# EAGLE design Grove - Recorder v2.0 (EAGLE 7.1.0)
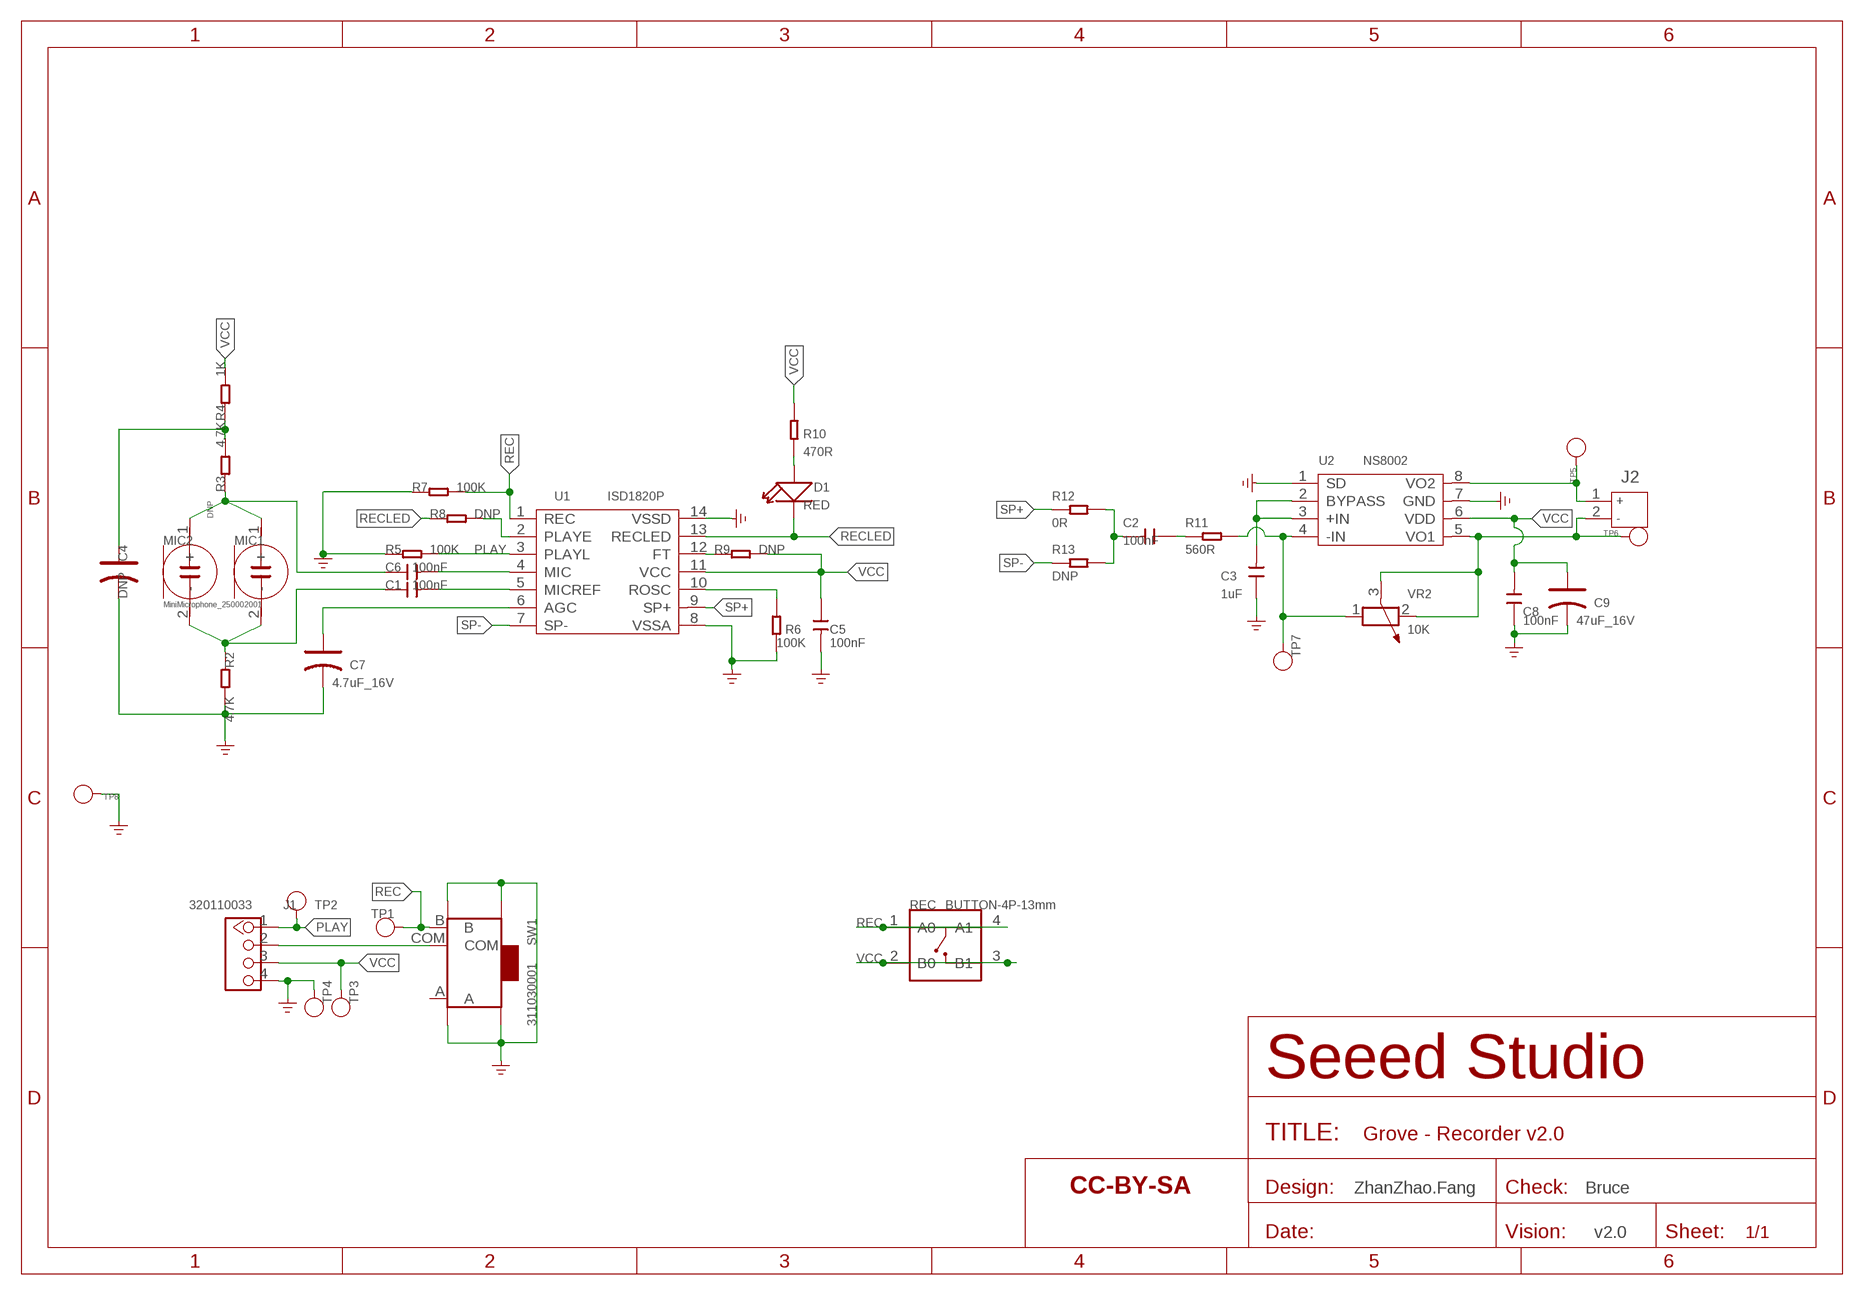
[diagram p0: schematic, sheet 1]

## Parts
C1  100nF  C-0402  [C0402]
C2  100nF  CAP-0603  [C0603]
C3  1uF  CAP-0402  [C0402]
C4  DNP  CAP-AVX-A  [AVX-A]
C5  100nF  C-0402  [C0402]
C6  100nF  C-0402  [C0402]
C7  4.7uF_16V  C-POLAR-A  [AVX-A]
C8  100nF  CAP-0402  [C0402]
C9  47uF_16V  C-POLAR-B  [AVX-B]
D1  RED  LED'RIGHT'  [LED-SIDE-VIEW-0603-RIGHT]
FR1  SEEEDSTUDIO-OPEN-SCH-FRAME  [SEEEDSTUDIO-PCB-FRAME]
J1  320110033  GROVE-CONNECTOR-DIP-2.0  [HW4-2.0]
J2  2P-2.0  JACK-JST-2P-PW'2.0'  [JST-2.0]
MIC1  MiniMicrophone_250002001  MICROPHONE  [2P-D8.9MM]
MIC2  DNP  MICROPHONE  [2P-D8.9MM]
R2  4.7K  R-0402  [R0402]
R3  4.7K  R-0402  [R0402]
R4  1K  R-0402  [R0402]
R5  100K  R-0402  [R0402]
R6  100K  R-0402  [R0402]
R7  100K  R-0402  [R0402]
R8  DNP  R-0402  [R0402]
R9  DNP  R-0402  [R0402]
R10  470R  R-0402  [R0402]
R11  560R  RES-0402  [R0402]
R12  0R  R-0402  [R0402]
R13  DNP  R-0402  [R0402]
REC  BUTTON-4P-13mm  BUTTON-4P-3110040P1  [4P-6.0X6.0X5.0H]
SW1  311030001  SWITCH-3+4P  [SW7-SMD-L6.7X2.7X3.2MM]
TP1  DNP  TEST-POINT'4545'  [TP-D45MIL]
TP2  DNP  TEST-POINT'4545'  [TP-D45MIL]
TP3  DNP  TEST-POINT'4545'  [TP-D45MIL]
TP4  DNP  TEST-POINT'4545'  [TP-D45MIL]
TP5  DNP  PAD-TEST-POINT'4545'  [TP_4545]
TP6  DNP  PAD-TEST-POINT'4545'  [TP_4545]
TP7  DNP  TEST-POINT'4545'  [TP-D45MIL]
TP8  DNP  PAD-TEST-POINT'4545'  [TP_4545]
U1  ISD1820P  [DIP14]
U2  NS8002  AMPLIFIER-NS8002  [SOIC8-1.27-5X4MM]
VR2  10K  RES-ADJ-SX3362P  [ADJR3-7.0X7.0X5.0MM]

## Nets
GND: C3.1 C4.- C5.2 C7.- C8.1 C9.- J1.4 R2.2 R5.1 R6.1 R7.1 SW1.SS1 SW1.SS2 SW1.SS3 SW1.SS4 TP4.T TP8.T U1.8(VSSA) U1.14(VSSD) U2.1(SD) U2.7(GND) ; supply symbol labelled GND_POWER
N$1: R8.2 U1.2(PLAYE)
N$2: D1.1(+) R10.1
N$3: J2.1 TP5.T U2.8(VO2)
N$4: J2.2 TP6.T U2.5(VO1) VR2.2 VR2.3
N$6: C7.+ U1.6(AGC)
N$7: C1.2 U1.5(MICREF)
N$8: C6.2 U1.4(MIC)
N$9: C3.2 U2.2(BYPASS) U2.3(+IN)
N$11: C2.1 R11.1
N$12: R11.2 TP7.T U2.4(-IN) VR2.1
N$13: R9.1 U1.12(FT)
N$14: C2.2 R12.1 R13.1
N$15: R6.2 U1.10(ROSC)
N$16: C4.+ R3.2 R4.1
N$17: J1.2 SW1.COM
N$19: C6.1 MIC1.1(+) MIC2.1(+) R3.1
N$20: C1.1 MIC1.2(-) MIC2.2(-) R2.1
PLAY: J1.1 R5.2 TP2.T U1.3(PLAYL)
REC: R7.2 REC.1(A0) REC.4(A1) SW1.B TP1.T U1.1(REC)
RECLED: D1.2(-) R8.1 U1.13(RECLED)
SP+: R12.2 U1.9(SP+)
SP-: R13.2 U1.7(SP-)
VCC: C5.1 C8.2 C9.+ J1.3 R4.2 R9.2 R10.2 REC.2(B0) REC.3(B1) TP3.T U1.11(VCC) U2.6(VDD)
Unconnected: SW1.A

## Notes on the sheet
- ZhanZhao.Fang | Bruce
- v2.0

## Library data of the parts
C1 C5 C6 = Discrete:C*: Ceramic Capacitors
C2 C3 C8 = Discrete-new:CAP: Ceramic Capacitors
C4 = Discrete:CAP*: Electrolytic Capacitors,Tantalum Capacitors and Super Capacitors
C7 C9 = OPL:C-POLAR*
D1 = Discrete:LED*
FR1 = moudle-new:SEEEDSTUDIO-OPEN-SCH-FRAME
J1 = Connector-new:GROVE-CONNECTOR-DIP: 4P-2.0:320110033;4P-2.0-90D:320110034
J2 = Connector :JACK-JST-2P-PW
MIC1 MIC2 = Discrete:MICROPHONE
R2-R10 R12 R13 = Discrete:R*
R11 = Discrete-new:RES
REC = OPL:BUTTON-4P
SW1 = Discrete-new:SWITCH-3+4P: SW7-SMD-6.7X2.6X1.4MM-90D:311030002;SW7-SMD-L6.7X2.7X3.2MM:311030001
TP1-TP4 TP7 = Discrete-new:TEST-POINT; PARTNO: DNP
TP5 TP6 TP8 = Discrete:PAD-TEST-POINT; PARTNO: DNP
U1 = template:ISD1820P
U2 = IC-new:AMPLIFIER-NS8002: 310020023
VR2 = Discrete-new:RES-ADJ: Potentiometer

## Net classes
0 default: width 0.152 mm, drill 0.305 mm, clearance 0.152 mm
3 none3: width 0.203 mm, drill 0.305 mm, clearance 0.203 mm

## Board
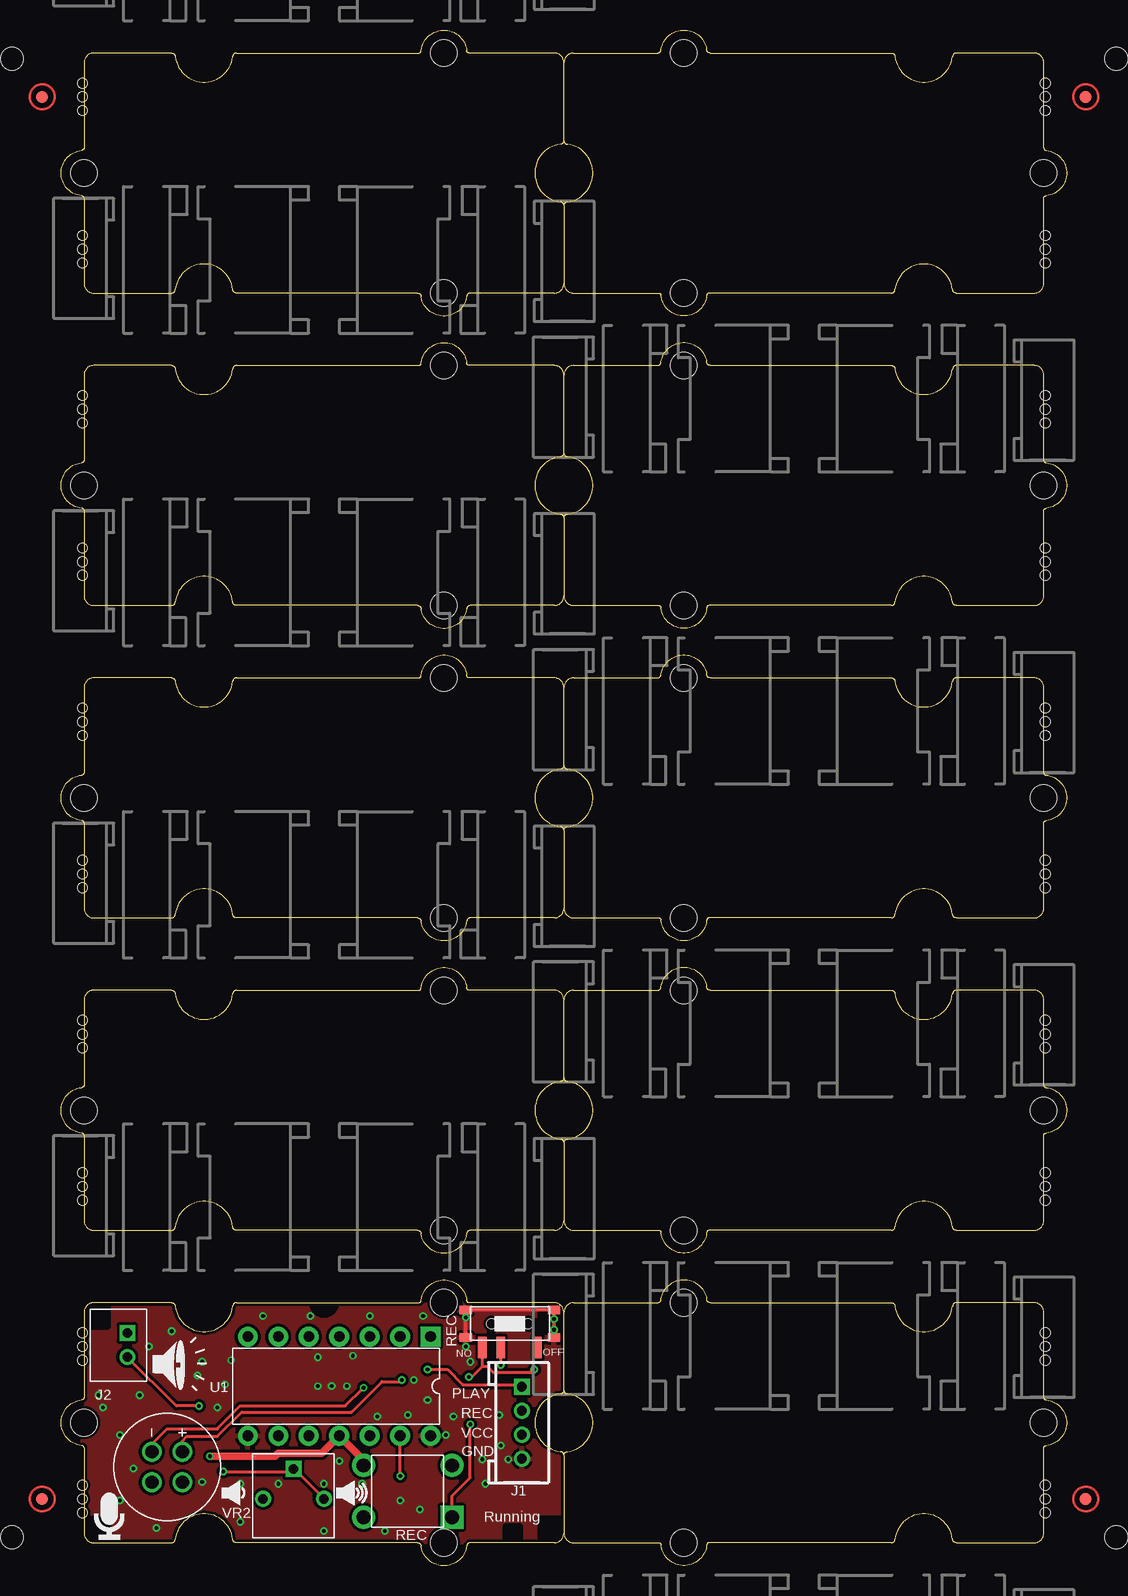
[diagram p1: board, top side]
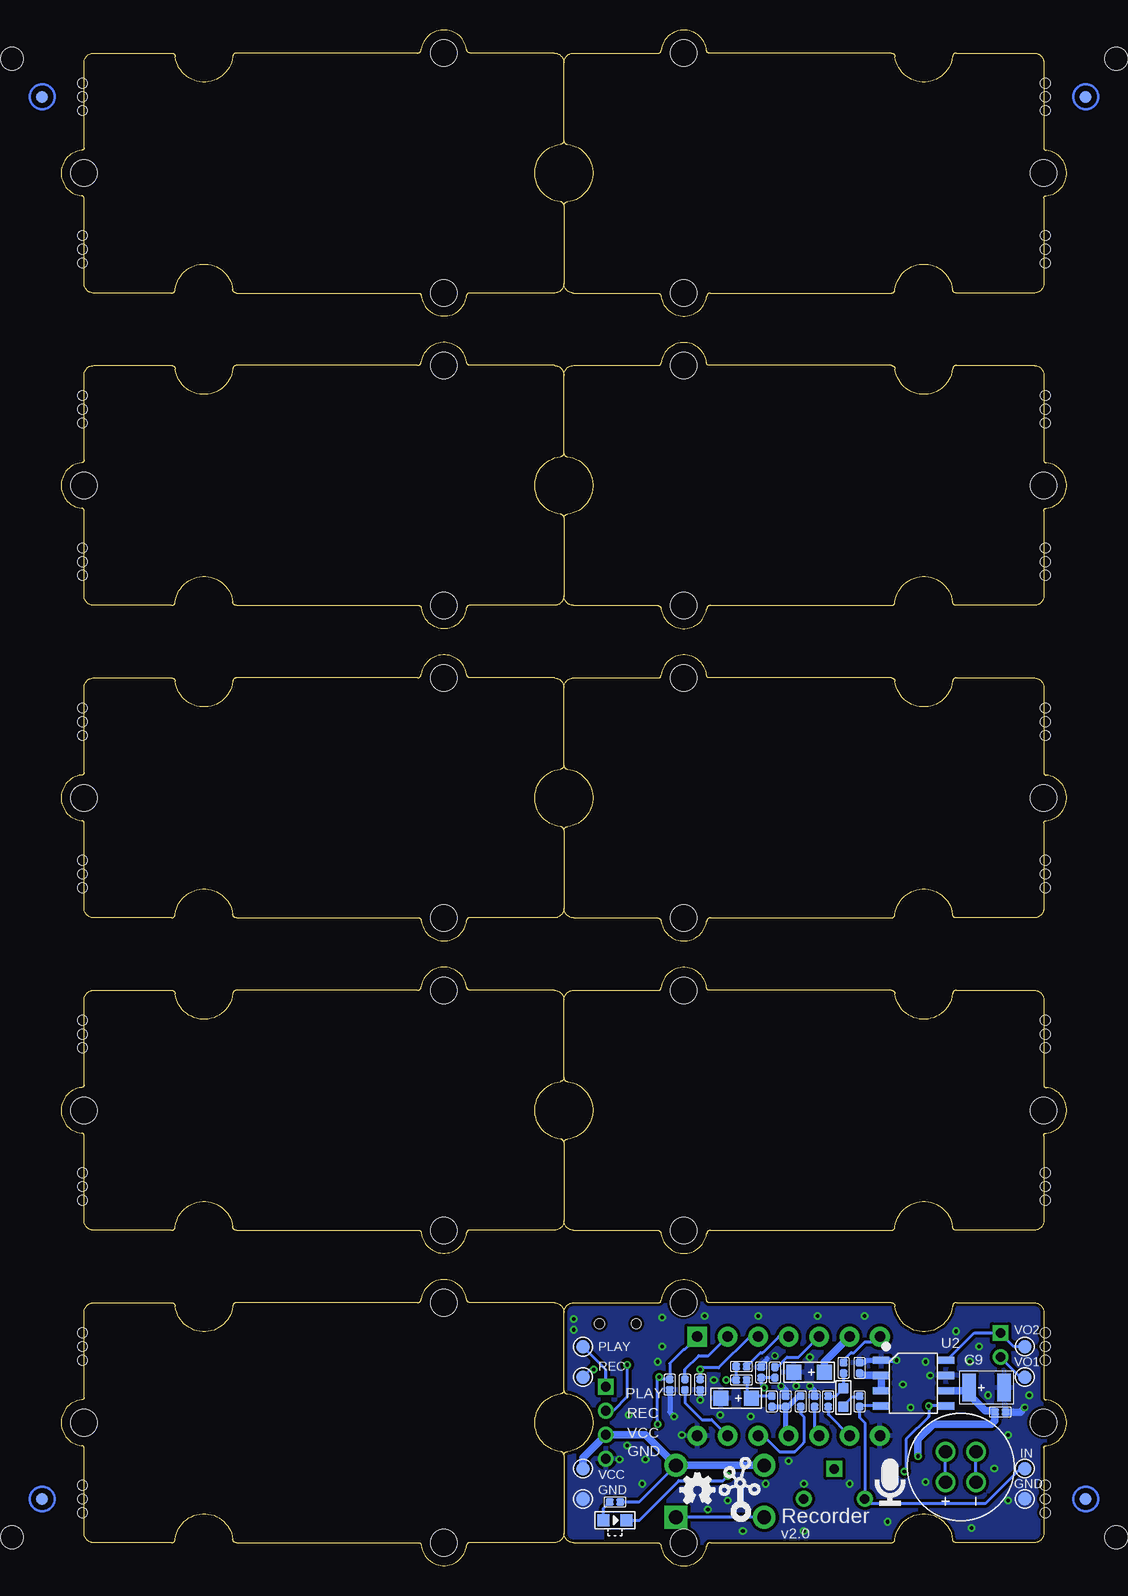
[diagram p2: board, bottom side, seen from below]

Size 83.82 x 127.98 mm. Coordinates in mm from the lower left corner, seen from the top.
Copper layers (1*16): Top 0.035mm / dielectric 1.5mm / Bottom 0.035mm
Design rules "default *": minimum track width 6mil, minimum drill 12mil, track to track 6mil, track to pad 6mil, pad to pad 6mil, via to via 6mil, smd to smd 0mil, copper to edge 10mil, drill to drill 10mil, minimum pad ring 10mil, minimum via ring 6mil, stop-mask expansion 2mil, vias tented up to drill 100mil, thermal gap 10mil
Holes 0.8 mm at 82.04,4.43 82.04,6.71 82.04,5.57 82.04,17.13 82.04,19.41 82.04,18.27 82.04,30.46 82.04,32.75 82.04,31.61 82.04,43.16 82.04,45.45 82.04,44.31 82.04,56.5 82.04,58.78 82.04,57.64 82.04,69.2 82.04,71.48 82.04,70.34 82.04,82.53 82.04,84.82 82.04,83.68 82.04,95.23 82.04,97.52 82.04,96.38 82.04,108.57 82.04,110.85 82.04,109.71 82.04,121.27 82.04,123.55 82.04,122.41 1.78,6.71 1.78,4.43 1.78,5.57 1.78,19.41 1.78,17.13 1.78,18.27 1.78,32.75 1.78,30.46 1.78,31.61 1.78,45.45 1.78,43.16 1.78,44.31 1.78,58.78 1.78,56.5 1.78,57.64 1.78,71.48 1.78,69.2 1.78,70.34 1.78,84.82 1.78,82.53 1.78,83.68 1.78,97.52 1.78,95.23 1.78,96.38 1.78,110.85 1.78,108.57 1.78,109.71 1.78,123.55 1.78,121.27 1.78,122.41
Holes 1.91 mm at 87.95,125.59 -4.13,125.59 -4.13,2.4 87.95,2.4
tRestrict: area 37,2 to 38.3,3.3
bRestrict: area 37,2 to 38.3,3.3

### Footprints (pad centres in the part's own frame; a part is rotated, then mirrored left to right if it is on the bottom)
C0402 = smd 0.635 x 0.635: 1 -0.445,0; 2 0.445,0
C0603 = smd 0.889 x 0.889: 1 0,0.762; 2 0,-0.762
C0402' = smd 0.635 x 0.635: 1 0,0.445; 2 0,-0.445
AVX-A = smd 1.27 x 1.27: + -1.27,0; - 1.27,0
AVX-B = smd 1.143 x 2.286: + -1.46,0; - 1.46,0
LED-SIDE-VIEW-0603-RIGHT = smd 1 x 1: 1 0,-0.95; 2 0,0.95
HW4-2.0 = drill 0.8 pad 1.27 square: 1 -3,0 | drill 0.8 pad 1.27: 2 -1,0; 3 1,0; 4 3,0
JST-2.0 = drill 0.8 pad 1.3 square: 1 -1,0.75 | drill 0.8 pad 1.3: 2 1,0.75
2P-D8.9MM = drill 1.1: 1 -1.27,1.27; 2 -1.27,-1.27
ROUND-MARK-1.0 = smd 1.016 x 1.016: P$1 0,0
R0402 = smd 0.635 x 0.635: 1 -0.445,0; 2 0.445,0
R0402' = smd 0.635 x 0.635: 1 0,0.445; 2 0,-0.445
4P-6.0X6.0X5.0H = drill 1.143 pad 1.905 square: 1 -3.683,2.159 | drill 1.143 pad 1.905: 2 -3.683,-2.159; 3 3.683,-2.159; 4 3.683,2.159
SW7-SMD-L6.7X2.7X3.2MM = smd 1.8 x 0.7: A 1.978,2.286; B 1.978,-2.286; COM 1.978,-0.762 | smd 0.7 x 1.016: SS1 -1.15,-3.683; SS2 1.15,-3.683; SS3 1.15,3.683; SS4 -1.15,3.683 | hole 0.813: 0,-1.524; 0,1.524
TP-D45MIL = smd 1.143 x 1.143: T 0,0
TP_4545 = smd 1.143 x 1.143: T 0,0
DIP14 = drill 0.889 pad 1.651 square: 1 -7.62,-4 | drill 0.889 pad 1.651: 2 -5.08,-4; 3 -2.54,-4; 4 0,-4; 5 2.54,-4; 6 5.08,-4; 7 7.62,-4; 8 7.62,4.255; 9 5.08,4.255; 10 2.54,4.255; 11 0,4.255; 12 -2.54,4.255; 13 -5.08,4.255; 14 -7.62,4.255
SOIC8-1.27-5X4MM = smd 0.6 x 1.4: 1 -1.905,-2.7; 2 -0.635,-2.7; 3 0.635,-2.7; 4 1.905,-2.7; 5 1.905,2.7; 6 0.635,2.7; 7 -0.635,2.7; 8 -1.905,2.7
GROVE-TEST-PLATFORM = hole 2.2: -10,-10; -10,10; 20,0
GROVE-2CONNECTOR = hole 2.2: -10,-10; -10,10; 20,0
ADJR3-7.0X7.0X5.0MM = drill 0.8 pad 1.35: 1 -2.54,-0.25; 2 2.54,-0.25 | drill 0.8 pad 1.35 square: 3 0,2.25

### Placement (x,y rotation side)
C1  24.32,16.11 90 bottom
C2  18.61,14.02 180 bottom
C3  1uF  [C0402']  17.27,16.49 0 bottom
C4  27.55,13.96 180 bottom
C5  23.43,13.7 90 bottom
C6  27.12,16.62 0 bottom
C7  21.46,16.12 180 bottom
C8  100nF  [C0402']  5.53,12.81 270 bottom
C9  6.67,14.84 0 bottom
D1  37.66,3.79 270 bottom
FR1  -14.67,-21.48 0 top  (outside the outline)
J1  38.41,11.92 270 top
J2  4.76,18.4 270 top
MIC1  8.83,8.24 270 top
MIC2  8.83,8.24 90 bottom
P1  [ROUND-MARK-1.0]  85.41,122.41 180 top
P2  [ROUND-MARK-1.0]  -1.59,122.41 180 top
P3  [ROUND-MARK-1.0]  85.41,5.57 180 top
P4  [ROUND-MARK-1.0]  -1.59,5.57 180 top
P5  [ROUND-MARK-1.0]  85.41,122.41 180 bottom
P6  [ROUND-MARK-1.0]  -1.59,122.41 180 bottom
P7  [ROUND-MARK-1.0]  -1.59,5.57 180 bottom
P8  [ROUND-MARK-1.0]  85.41,5.57 180 bottom
R2  25.47,16.12 90 bottom
R3  27.12,15.48 0 bottom
R4  24.58,13.7 270 bottom
R5  30.54,15.1 90 bottom
R6  21.02,13.7 270 bottom
R7  33.08,15.1 90 bottom
R8  31.81,15.1 90 bottom
R9  22.16,13.7 90 bottom
R10  37.66,5.32 0 bottom
R11  560R  [R0402']  17.27,13.7 0 bottom
R12  19.88,13.7 270 bottom
R13  18.6,16.49 90 bottom
REC  28.89,6.21 180 top
SW1  37.41,20.18 270 top
TP1  40.32,15.73 0 bottom
TP2  40.32,18.27 0 bottom
TP3  40.32,8.11 0 bottom
TP4  40.32,5.57 0 bottom
TP5  3.49,18.27 0 bottom
TP6  3.49,15.73 0 bottom
TP7  3.49,8.11 0 bottom
TP8  3.49,5.57 0 bottom
U1  23.18,15.1 180 top
U2  12.76,15.22 270 bottom
U3  [GROVE-TEST-PLATFORM]  21.91,90.03 180 top
U4  [GROVE-TEST-PLATFORM]  61.91,90.03 0 top
U5  [GROVE-TEST-PLATFORM]  21.91,63.99 180 top
U6  [GROVE-TEST-PLATFORM]  61.91,63.99 0 top
U7  [GROVE-TEST-PLATFORM]  21.91,37.96 180 top
U8  [GROVE-TEST-PLATFORM]  61.91,37.96 0 top
U9  [GROVE-TEST-PLATFORM]  61.91,11.92 0 top
U10  [GROVE-TEST-PLATFORM]  21.91,11.92 180 top
U11  [GROVE-TEST-PLATFORM]  21.91,116.06 180 top
U12  [GROVE-TEST-PLATFORM]  61.91,116.06 0 top
U$9  [GROVE-2CONNECTOR]  21.91,11.92 180 top
U$10  [TWIGLOGO_SMALL]  29.4,3.54 0 bottom
U$11  [OSHW_FILLX100_NOTEXT]  32.2,5.19 0 bottom
VR2  19.37,5.83 0 top

### Tracks (layer width: path | path; a pad name or v marks a point on that pad's centre or on a via)
GND  (via drill 0.3, 0.3 pad 0.64)
  Top 0.305: SW1.SS3 SW1.SS4 SW1.SS1 SW1.SS2
  Bottom 0.406: R5.1 v30.54,13.83 | R7.1 33.08,12.81 v32.7,12.43 | R2.2 25.47,16.74 24.96,17.26 | R6.1 21.02,14.59 v21.4,14.97 | C3.1 16.89,16.94 16.7,17.13 U2.1 v14.16,17.13
  Bottom 0.61: C8.1 3.87,12.81 v3.49,13.19 | C5.2 23.43,14.59 v23.81,14.97
  other vias: 21.4,17.38 32.07,10.91 37.28,8.87 26.35,12.43 21.91,6.84 9.21,19.54 3.11,14.21 35.12,8.87 18.1,6.84 11.75,6.97 4.89,5.44 4.89,10.91 33.72,18.27 33.72,20.68 41.09,20.56 41.09,19.67 30.16,20.81 25.72,20.81 20.77,20.81 16.83,20.81 21.91,2.9 26.99,2.9 29.91,4.68 25.08,6.84 28.26,5.44 11.37,15.86 24.32,17.51 22.54,14.97 28.89,12.56 29.4,15.48 35.37,6.84 36.64,10.02 36.51,12.56 34.1,17 7.3,18.27 8.07,17 6.54,14.21 11.75,17 13.02,13.19 13.65,15.1 6.03,8.11 7.94,3.16 14.92,6.84 14.92,3.67 23.18,8.75
  pour Bottom (isolate 0.254): 1.59,22.72 42.86,22.72 42.86,1.13 1.59,1.13
  pour Top (isolate 0.254): 1.59,22.72 42.86,22.72 42.86,1.13 1.59,1.13
N$1
  Bottom 0.254: R8.2 31.81,16.37 30.67,17.51 29.85,17.51 U1.2
N$2
  Bottom 0.254: D1.1 38.61,4.81 R10.1
N$3
  Bottom 0.254: TP5.T 4.39,18.27 J2.1 5.53,19.41 7.68,19.41 9.97,17.13 U2.8
N$4  (via drill 0.3)
  Top 0.254: v11.49,13.32 9.59,13.32 J2.2 | v13.53,7.86 19.15,7.86 VR2.3 19.41,8.08 VR2.2
  Bottom 0.254: TP6.T 3.85,15.73 J2.2 | U2.5 v11.49,13.32 11.49,12.43 13.4,10.52 13.4,7.98 v13.53,7.86
N$6
  Bottom 0.61: C7.+ 20.19,17.01 U1.6
N$7
  Bottom 0.254: U1.5 22.35,17.38 23.31,17.38 24.13,16.56 C1.2
N$8
  Bottom 0.254: U1.4 24,19.1 25.34,17.76 25.53,17.76 C6.2
N$9
  Bottom 0.61: U2.3 U2.2 17.08,15.86 C3.2
N$11
  Bottom 0.254: C2.1 18.61,13.32 17.84,14.08 17.33,14.08 R11.1
N$12
  Bottom 0.254: TP7.T 3.88,8.11 6.8,5.19 16.44,5.19 VR2.1 16.83,11.92 17.27,12.36 R11.2 17.2,13.32 U2.4
N$13
  Bottom 0.254: U1.12 25.27,10.84 23.94,9.51 22.67,9.51 21.91,10.27 21.91,12.43 22.16,12.68 R9.1
N$14
  Bottom 0.254: R13.1 C2.2 19.25,14.14 R12.1
N$15
  Bottom 0.254: R6.2 21.02,11.22 U1.10
N$16
  Bottom 0.254: R3.2 26.67,14.35 C4.+ 26.1,14.14 R4.1
N$17  (via drill 0.3 pad 0.64)
  Top 0.254: SW1.COM v36.65,16.75 v36.64,16.75
  Bottom 0.254: v36.64,16.75 36.64,14.08 37.8,12.92 J1.2
N$19  (via drill 0.3)
  Top 0.254: MIC1.1 10.1,10.4 10.48,10.78 13.02,10.78 15.05,12.81 24.19,12.81 26.73,15.35 28.26,15.35 v28.39,15.48
  Bottom 0.254: MIC2.1 MIC1.1 | C6.1 R3.1 v28.39,15.48
N$20  (via drill 0.3)
  Top 0.254: MIC1.2 7.56,10.14 8.83,11.41 13.02,11.41 14.92,13.32 23.69,13.32 v25.21,14.84
  Bottom 0.254: MIC2.2 MIC1.2 | C1.1 R2.1 25.47,15.1 v25.21,14.84
PLAY  (via drill 0.3 pad 0.64)
  Top 0.254: v30.54,16.37 32.2,16.37 33.47,15.1 38.24,15.1 J1.1
  Bottom 0.254: J1.1 38.41,16.36 TP2.T | R5.2 v30.54,16.37 30.42,16.49 29.02,16.49 26.42,19.1 U1.3
REC  (via drill 0.3)
  Top 0.254: v33.97,15.73 34.23,15.73 35.12,16.62 | 35.12,16.62 SW1.B | 35.12,16.62 35.5,16.62 36.01,16.11 39.18,16.11 v39.43,16.37 | REC.1 32.58,5.83 34.1,7.35 v34.1,11.79
  Bottom 0.254: U1.1 31.88,18.02 31.94,18.02 33.08,16.87 R7.2 33.78,15.54 v33.97,15.73 34.1,15.6 v34.1,11.79 | REC.4 REC.1 | v39.43,16.37 39.68,16.37 TP1.T
RECLED  (via drill 0.3 pad 0.64)
  Top 0.254: v28.26,7.48 U1.13
  Bottom 0.254: D1.2 35.62,3.79 32.32,7.1 28.64,7.1 v28.26,7.48 | R8.1 31.81,13.57 30.42,12.18 29.59,12.18 U1.13
SP+
  Bottom 0.254: R12.2 19.88,12.63 U1.9
SP-
  Bottom 0.254: R13.2 18.6,17.13 17.97,17.76 17.72,17.76 16.83,18.65 16,18.65 U1.7
VCC  (via drill 0.3)
  Top 0.61: REC.3 25.21,8.81 U1.11 21.72,9.38 18.1,9.38 17.84,9.13 v12.38,9.13
  Bottom 0.254: R10.2 35.62,5.32 REC.2
  Bottom 0.406: R4.2 C5.1 | R9.2 22.35,14.14 23.24,13.25 C5.1 | C5.1 23.43,11.1 U1.11
  Bottom 0.61: REC.3 REC.2 35.13,10.92 J1.3 40.32,9.01 TP3.T | U2.6 8.38,14.59 C9.+ 8.13,14.27 6.8,12.94 6.1,12.94 C8.2 5.98,12.11 6.29,11.79 11.11,11.79 12.38,10.52 v12.38,9.13

### Text on the board
tPlace: REC | ON | OFF | PLAY | REC | VCC | GND | Running
bPlace: VO2 | PLAY | VO1 | REC | PLAY | REC | VCC | IN | GND | GND | VCC | GND | Recorder | v2.0